# Altium schematic sheet +-9V Supply.SchDoc
size 330 x 203 mm; SheetNumber: 12; SheetTotal: 14
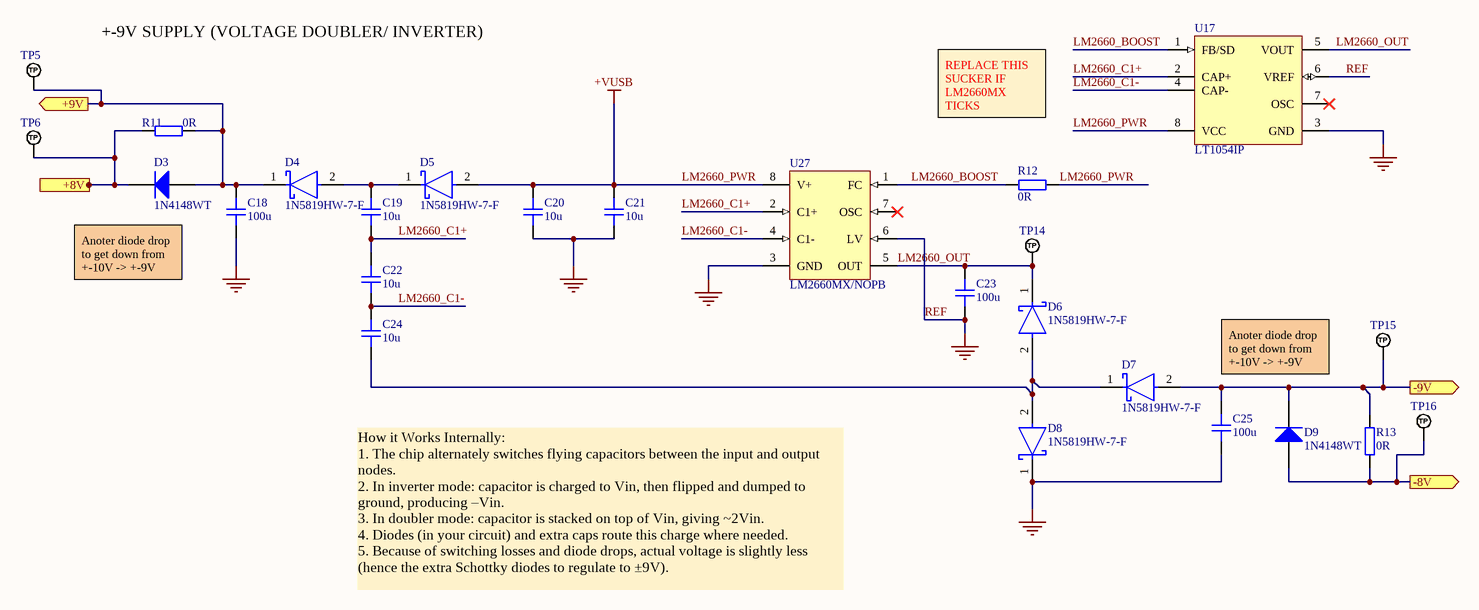
[diagram p0: +-9V Supply.SchDoc]

## Parts
C18  100u  [CAP_1210]
C19  10u  [CAP_1210]
C20  10u  [CAP_1210]
C21  10u  [CAP_1210]
C22  10u  [CAP_1210]
C23  100u  [CAP_1210]
C24  10u  [CAP_1210]
C25  100u  [CAP_1210]
D3  1N4148WT  [FAIR-SOD-523F-2_V]
D4  1N5819HW-7-F  [FP-SOD123-IPC_A]
D5  1N5819HW-7-F  [FP-SOD123-IPC_A]
D6  1N5819HW-7-F  [FP-SOD123-IPC_A]
D7  1N5819HW-7-F  [FP-SOD123-IPC_A]
D8  1N5819HW-7-F  [FP-SOD123-IPC_A]
D9  1N4148WT  [FAIR-SOD-523F-2_V]
R11  0R  [RES_0603]
R12  0R  [RES_0603]
R13  0R  [RES_0603]
TP5  TP_NOBOM  [PAD_RND_1MM]  (value not drawn)  (no BOM)
TP6  TP_NOBOM  [PAD_RND_1MM]  (value not drawn)  (no BOM)
TP14  TP_NOBOM  [PAD_RND_1MM]  (value not drawn)  (no BOM)
TP15  TP_NOBOM  [PAD_RND_1MM]  (value not drawn)  (no BOM)
TP16  TP_NOBOM  [PAD_RND_1MM]  (value not drawn)  (no BOM)
U17  LT1054IP  [P0008A]
U27  LM2660MX/NOPB  [D0008A_M]

## Ports
+8V (out), +9V (out), -8V (out), -9V (out)

## Nets
LM2660_PWR: C20.2 C21.2 D5.2(A) R12.1 U17.8(VCC) U27.8(V+)  [also labelled +VUSB]
REF: C18.1 C20.1 C21.1 C23.1 C25.1 D8.1(C) U17.3(GND) U17.6(VREF) U27.3(GND) U27.6(LV)  [also labelled GND]
+8V: D3.1(K) R11.1 TP6.1(TP) ; port +8V
+9V: C18.2 D3.2(A) D4.1(C) R11.2 TP5.1(TP) ; port +9V
-8V: D9.2(A) R13.1 TP16.1(TP) ; port -8V
-9V: C25.2 D7.2(A) D9.1(K) R13.2 TP15.1(TP) ; port -9V
LM2660_BOOST: R12.2 U17.1(FB/SD) U27.1(FC)
LM2660_C1+: C19.1 C22.2 U17.2(CAP+) U27.2(C1+)
LM2660_C1-: C22.1 C24.2 U17.4(CAP-) U27.4(C1-)
LM2660_OUT: C23.2 D6.1(C) TP14.1(TP) U17.5(VOUT) U27.5(OUT)
NetC19_2: C19.2 D4.2(A) D5.1(C)
NetC24_1: C24.1 D6.2(A) D7.1(C) D8.2(A)

Not connected (* = marked no-connect by the designer): U17 7(OSC)*; U27 7(OSC)*

## Notes on the sheet
- +-9V SUPPLY (VOLTAGE DOUBLER/ INVERTER)
- REPLACE THIS SUCKER IF LM2660MX TICKS
- Anoter diode drop to get down from +-10V -> +-9V
- How it Works Internally:
  1. The chip alternately switches flying capacitors between the input and output nodes.
  2. In inverter mode: capacitor is charged to Vin, then flipped and dumped to ground, producing –Vin.
  3. In doubler mode: capacitor is stacked on top of Vin, giving ~2Vin.
  4. Diodes (in your circuit) and extra caps route this charge where needed.
  5. Because of switching losses and diode drops, actual voltage is slightly less (hence the extra Schottky diodes to regulate to ±9V).

## Library data of the parts
C18-C25 = CAP_1210: Capacitor SMD 1210; Manufacturer: *; Manufacturer Part Number: *; Distributor Link: *; LCSC: *; Rating: *; Dielectric: *
D3 D9 = CMP-0881-00001-1: High Conductance Fast Switching Diode, 75 V, -55 to 150 degC, 2-Pin SOD523F, RoHS; Manufacturer: Fairchild Semiconductor; IR (VR: 75 V)=5 uA Max.; VF: 1 V Max.; BVR (IR: 5 uA)=75 V Min.; CO: 4 pF Max.; DatasheetVersion: Rev. A2; ComponentLink1Description: Manufacturer URL; PackageDescription: 2-Pin Surface Mount Device, Body 1.2 x 0.8 mm, Height 0.7 mm; ComponentLink2URL: http://www.fairchildsemi.com/ds/1N/1N4148WT.pdf; ComponentLink2Description: Datasheet; PartNumber: 1N4148WT; ComponentLink1URL: http://www.fairchildsemi.com/; Temperature Range: -55 to 150 degC; Mounting Technology: Surface Mount; PackageReference: SOD-523F-2; RoHS: TRUE
D4-D8 = CMP-0303-00003-3: DIODE SCHOTTKY 40V 1A SOD123; Forward Voltage: 450mV; Capacitance: 110pF; Max Forward Surge Current (Ifsm): 25A; Peak Reverse Current: 50uA; Polarity: Standard; Element Configuration: Single; Max Power Dissipation: 450mW; Min Operating Temperature: -65°C; Package Quantity: 3000; Contact Plating: Tin; Weight: 0.000353oz; Max Repetitive Reverse Voltage (Vrrm): 40V; Max Reverse Voltage (DC): 40V; Height: 1.25mm; Average Rectified Current: 1A; Width: 1.7mm; Case/Package: SOD-123-2; Lead Free: Lead Free; Max Operating Temperature: 125°C; Current Rating: 1A; Termination: SMD/SMT; Forward Current: 1A; Radiation Hardening: No; Number of Pins: 2; Length: 2.85mm; Voltage Rating (DC): 40V; REACH SVHC: No SVHC; Peak Non-Repetitive Surge Current: 25A; Packaging: Tape and Reel; Output Current: 1A
R11-R13 = RES_0603: Resistor SMD 0603; Manufacturer: *; Manufacturer Part Number: *; Distributor Link: *; LCSC: *
TP5 TP6 TP14-TP16 = TEST_POINT_RND_1MM: Test Point Round 1mm (NO BOM)
U17 = CMP-0391-00173-2: -5 V, Buck / Boost Charge Pump, 100 mA, 3.5 to 15 V Input, -40 to 85 degC, 8-pin DIP (P8), Pb-Free (RoHS); Manufacturer: Texas Instruments; Vin(Min)(V): 3.5; Vout(Max)(V): -5.2; Iout(Max)(A): 0.1; Iq(Typ)(mA): 2.5; Switching Frequency(Max)(kHz): 35; Vout(Min)(V): -4.7; Vin(Max)(V): 15; ComponentLink3URL: http://www.ti.com/litv/pdf/mpdi001b; Eco-Plan: Pb-Free (RoHS); PackageVersion: 4040082/E; DatasheetVersion: SLVS033F; Mounting Technology: Through Hole; ComponentLink1Description: Manufacturer URL; Preset Vout(V): -5; Topology: Buck/Boost; ComponentLink1URL: http://www.ti.com/; ComponentLink2Description: Datasheet; ComponentLink3Description: Package Specification; PartNumber: LT1054IP; PackageDescription: 8-Pin Plastic In-Line, Body 9.59 x 6.35 mm, 2.54 mm Pitch; ComponentLink2URL: http://www.ti.com/general/docs/lit/getliterature.tsp?genericPartNumber=LT1054&fileType=pdf; PackageReference: P0008A; Code_JEDEC: MS-001
U27 = CMP-0065-00023-3: Switched Capacitor Voltage Converter, 8-pin Narrow SOIC, Pb-Free; Manufacturer: Texas Instruments; CompType: Switch Caps; PowerWise: N; PackageTopMarking: NSZXTT*LM26*60M; PackageReference: D0008A; ComponentLink1Description: Datasheet URL; PinCount: 8; PackageDescription: SOIC Narrow, 4.9 x 3.9 x 1.45mm, 8 Lead, 1.27mm Pitch; RoHS: Y; Code_IPC: SOIC127P600-8; Code_JEDEC: MS-012-AA; ComponentLink1URL: http://www.ti.com/general/docs/lit/getliterature.tsp?genericPartNumber=LM2660&fileType=pdf